# EAGLE schematic 4_channel_mosfet_v2 (EAGLE 9.7.0)
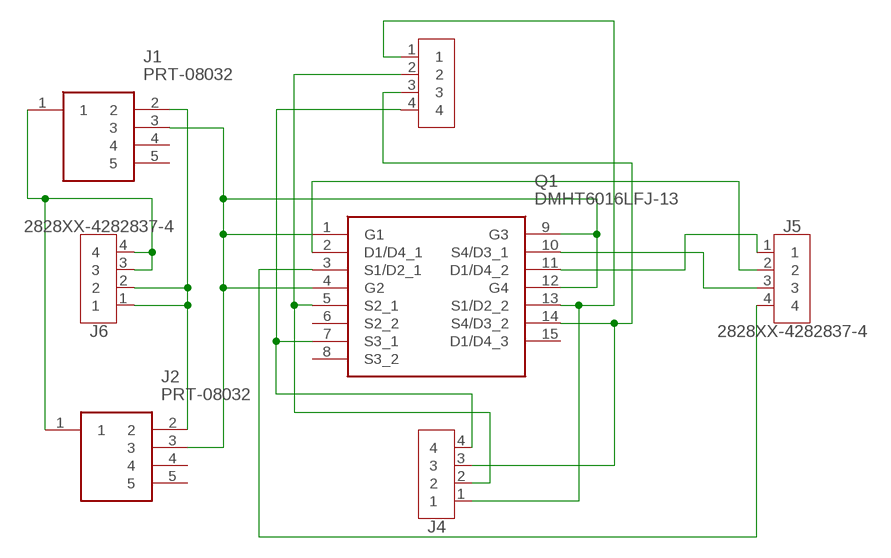
[diagram p0: schematic, sheet 1]

## Parts
J1  PRT-08032  [PRT08032]
J2  PRT-08032  [PRT08032]
J3  2828XX-4282837-4  [TERMBLK_508-4N]
J4  2828XX-4282837-4  [TERMBLK_508-4N]
J5  2828XX-4282837-4  [TERMBLK_508-4N]
J6  2828XX-4282837-4  [TERMBLK_508-4N]
Q1  DMHT6016LFJ-13  [DMHT6016LFJ13]

## Nets
N$1: J1.1 J2.1 J6.3 J6.4
N$2: J1.2 J2.2 J6.1 J6.2
N$3: J1.3 J2.3 Q1.1(G1) Q1.4(G2) Q1.9(G3) Q1.12(G4)
N$4: J3.4 J4.4 Q1.7(S3_1)
N$5: J3.1 J4.1 Q1.13(S1/D2_2)
N$6: J3.3 J4.3 Q1.14(S4/D3_2)
N$7: J3.2 J4.2 Q1.5(S2_1)
N$8: J5.3 Q1.10(S4/D3_1)
N$9: J5.1 Q1.11(D1/D4_2)
N$10: J5.2 Q1.2(D1/D4_1)
N$11: J5.4 Q1.3(S1/D2_1)
Unconnected: J1.4 J1.5 J2.4 J2.5 Q1.6(S2_2) Q1.8(S3_2) Q1.15(D1/D4_3)

## Library data of the parts
J1 J2 = SamacSys_Parts:PRT-08032: 3.50mm (0.141", 1/8", Mini Plug) - Headphone Phone Jack Stereo (3 Conductor, TRS) Connector Solder Source: Datasheet <https://www.sparkfun.com/datasheets/Prototyping/Audio-3.5mm.pdf>; ARROW_PART_NUMBER: PRT-08032; ARROW_PRICE-STOCK: https://www.arrow.com/en/products/prt-08032/sparkfun-electronics; DESCRIPTION: 3.50mm (0.141", 1/8", Mini Plug) - Headphone Phone Jack Stereo (3 Conductor, TRS) Connector Solder; HEIGHT: 6.15mm; MANUFACTURER_NAME: SparkFun; MANUFACTURER_PART_NUMBER: PRT-08032; MOUSER_PART_NUMBER: 474-PRT-08032; MOUSER_PRICE-STOCK: https://www.mouser.co.uk/ProductDetail/SparkFun/PRT-08032?qs=WyAARYrbSnZFBWwuc8Qktw%3D%3D
J3-J6 = Connector:2828XX-4: 4 Position Wire to Board Terminal Block Horizontal with Board Datasheet <https://www.te.com.cn/commerce/DocumentDelivery/DDEController?Action=showdoc&DocId=Catalog+Section%7F1308389_EUROSTYLE_TERMINAL_BLOCKS%7F0607%7Fpdf%7FEnglish%7FENG_CS_1308389_EUROSTYLE_TERMINAL_BLOCKS_0607.pdf%7F2-282837-5>; CATEGORY: Fixed Terminal Blocks; DESCRIPTION: Fixed Terminal Blocks 5.08MM PCB MOUNT 4P; MANUFACTURER: TE Connectivity AMP Connectors; MPN: 282837-4; OPERATING_TEMPERATURE: -40°C ~ 105°C; PART_STATUS: Active; PITCH: 0.200" (5.08mm); ROHS_COMPLIANCE: RoHS Compliant; SERIES: Buchanan; SUBCATEGORY: Terminal Blocks; TYPE: Through Hole; Screw - Rising Cage Clamp; Side wire entry, Horizontal with Board
Q1 = DMHT6016LFJ-13:DMHT6016LFJ-13: MOSFET MOSFET BVDSS: 41V-60V Source: Datasheet; DESCRIPTION: MOSFET MOSFET BVDSS: 41V-60V; HEIGHT: 0.8mm; MANUFACTURER_NAME: Diodes Incorporated; MANUFACTURER_PART_NUMBER: DMHT6016LFJ-13; MOUSER_PART_NUMBER: 621-DMHT6016LFJ-13; MOUSER_PRICE-STOCK: https://www.mouser.co.uk/ProductDetail/Diodes-Incorporated/DMHT6016LFJ-13?qs=AQlKX63v8RuRA1AfUZIZiQ%3D%3D